# Altium project Sonar_Analog_Shield.PrjPcb
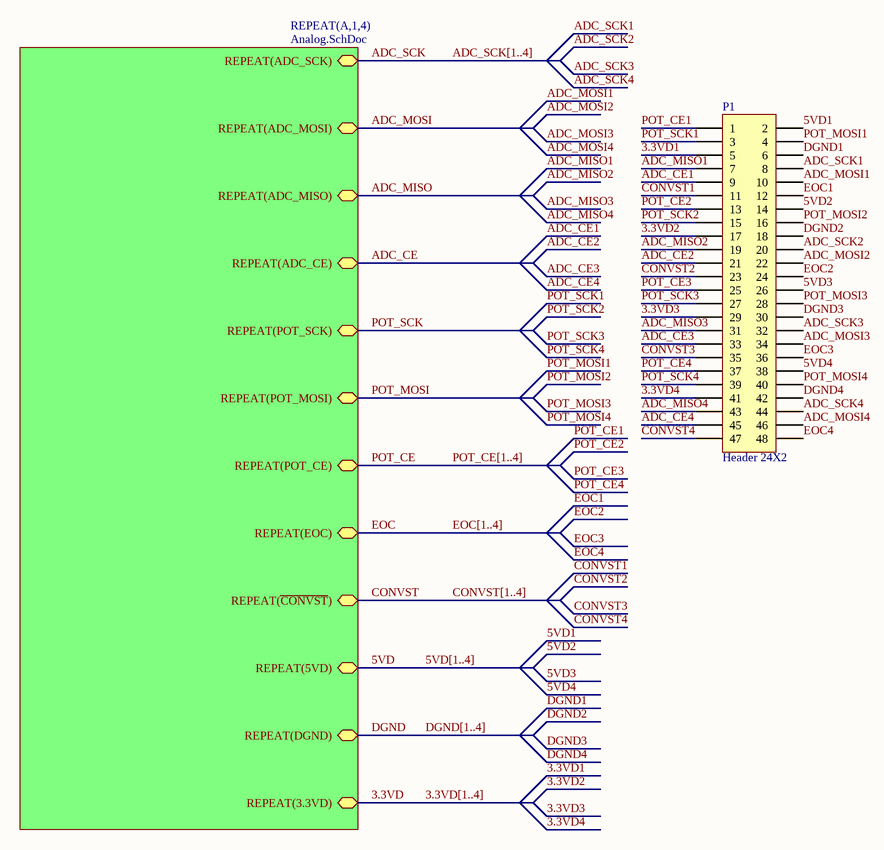
[diagram p0: Top_Level.SchDoc]
2 sheets, 165 parts. Net scope: hierarchical (ports join the sheet entries above them; power ports are global).
Board file: Analog_1.PcbDoc
Sheets:
  Top_Level.SchDoc
    A1 = Analog.SchDoc
    A2 = Analog.SchDoc
    A3 = Analog.SchDoc
    A4 = Analog.SchDoc

## Sheet Top_Level.SchDoc
size A

### Parts
P1  Header 24X2  [HDR2X24]

### Sub-sheets
REPEAT(A,1,4) = Analog.SchDoc: REPEAT(ADC_SCK) (bidir), REPEAT(ADC_MOSI) (bidir), REPEAT(ADC_MISO) (bidir), REPEAT(ADC_CE) (bidir), REPEAT(~{CONVST}) (bidir), REPEAT(EOC) (bidir), REPEAT(POT_SCK) (bidir), REPEAT(POT_MOSI) (bidir), REPEAT(POT_CE) (bidir), REPEAT(5VD) (bidir), REPEAT(DGND) (bidir), REPEAT(3.3VD) (bidir)

### Nets
5VD1: P1.2 P1.14 P1.26 P1.38  [also labelled 5VD2, 5VD3, 5VD4]
DGND1: P1.6 P1.18 P1.30 P1.42  [also labelled DGND2, DGND3, DGND4]  [project net DGND]
3.3VD: sheet REPEAT(A,1,4)/REPEAT(3.3VD)
3.3VD1: P1.5  [project net 3.3VD]
3.3VD2: P1.17  [project net 3.3VD]
3.3VD3: P1.29  [project net 3.3VD]
3.3VD4: P1.41  [project net 3.3VD]
5VD: sheet REPEAT(A,1,4)/REPEAT(5VD)
ADC_CE: sheet REPEAT(A,1,4)/REPEAT(ADC_CE)
ADC_CE1: P1.9
ADC_CE2: P1.21
ADC_CE3: P1.33
ADC_CE4: P1.45
ADC_MISO: sheet REPEAT(A,1,4)/REPEAT(ADC_MISO)
ADC_MISO1: P1.7
ADC_MISO2: P1.19
ADC_MISO3: P1.31
ADC_MISO4: P1.43
ADC_MOSI: sheet REPEAT(A,1,4)/REPEAT(ADC_MOSI)
ADC_MOSI1: P1.10
ADC_MOSI2: P1.22
ADC_MOSI3: P1.34
ADC_MOSI4: P1.46
ADC_SCK: sheet REPEAT(A,1,4)/REPEAT(ADC_SCK)
ADC_SCK1: P1.8
ADC_SCK2: P1.20
ADC_SCK3: P1.32
ADC_SCK4: P1.44
CONVST: sheet REPEAT(A,1,4)/REPEAT(~{CONVST})
CONVST1: P1.11
CONVST2: P1.23
CONVST3: P1.35
CONVST4: P1.47
DGND: sheet REPEAT(A,1,4)/REPEAT(DGND)
EOC: sheet REPEAT(A,1,4)/REPEAT(EOC)
EOC1: P1.12
EOC2: P1.24
EOC3: P1.36
EOC4: P1.48
POT_CE: sheet REPEAT(A,1,4)/REPEAT(POT_CE)
POT_CE1: P1.1  [project net POT_CE]
POT_CE2: P1.13  [project net POT_CE]
POT_CE3: P1.25  [project net POT_CE]
POT_CE4: P1.37  [project net POT_CE]
POT_MOSI: sheet REPEAT(A,1,4)/REPEAT(POT_MOSI)
POT_MOSI1: P1.4  [project net POT_MOSI]
POT_MOSI2: P1.16  [project net POT_MOSI]
POT_MOSI3: P1.28  [project net POT_MOSI]
POT_MOSI4: P1.40  [project net POT_MOSI]
POT_SCK: sheet REPEAT(A,1,4)/REPEAT(POT_SCK)
POT_SCK1: P1.3  [project net POT_SCK]
POT_SCK2: P1.15  [project net POT_SCK]
POT_SCK3: P1.27  [project net POT_SCK]
POT_SCK4: P1.39  [project net POT_SCK]

### Buses and harness runs
bus 3.3VD[1..4]
bus 5VD[1..4]
bus ADC_SCK[1..4]
bus CONVST[1..4]
bus DGND[1..4]
bus EOC[1..4]
bus POT_CE[1..4]

### Library data of the parts
P1 = Header 24X2: Header, 24-Pin, Dual row; LatestRevisionDate: 17-Jul-2002; LatestRevisionNote: Re-released for DXP Platform.; Publisher: Altium Limited; Supplier Part Number 1: 952-1917-ND; Supplier 1: Digi-Key

## Sheet Analog.SchDoc
size 381 x 241 mm
Used 4 times, as channels A1, A2, A3, A4. Parts and nets are listed once, with the designators drawn on the sheet.
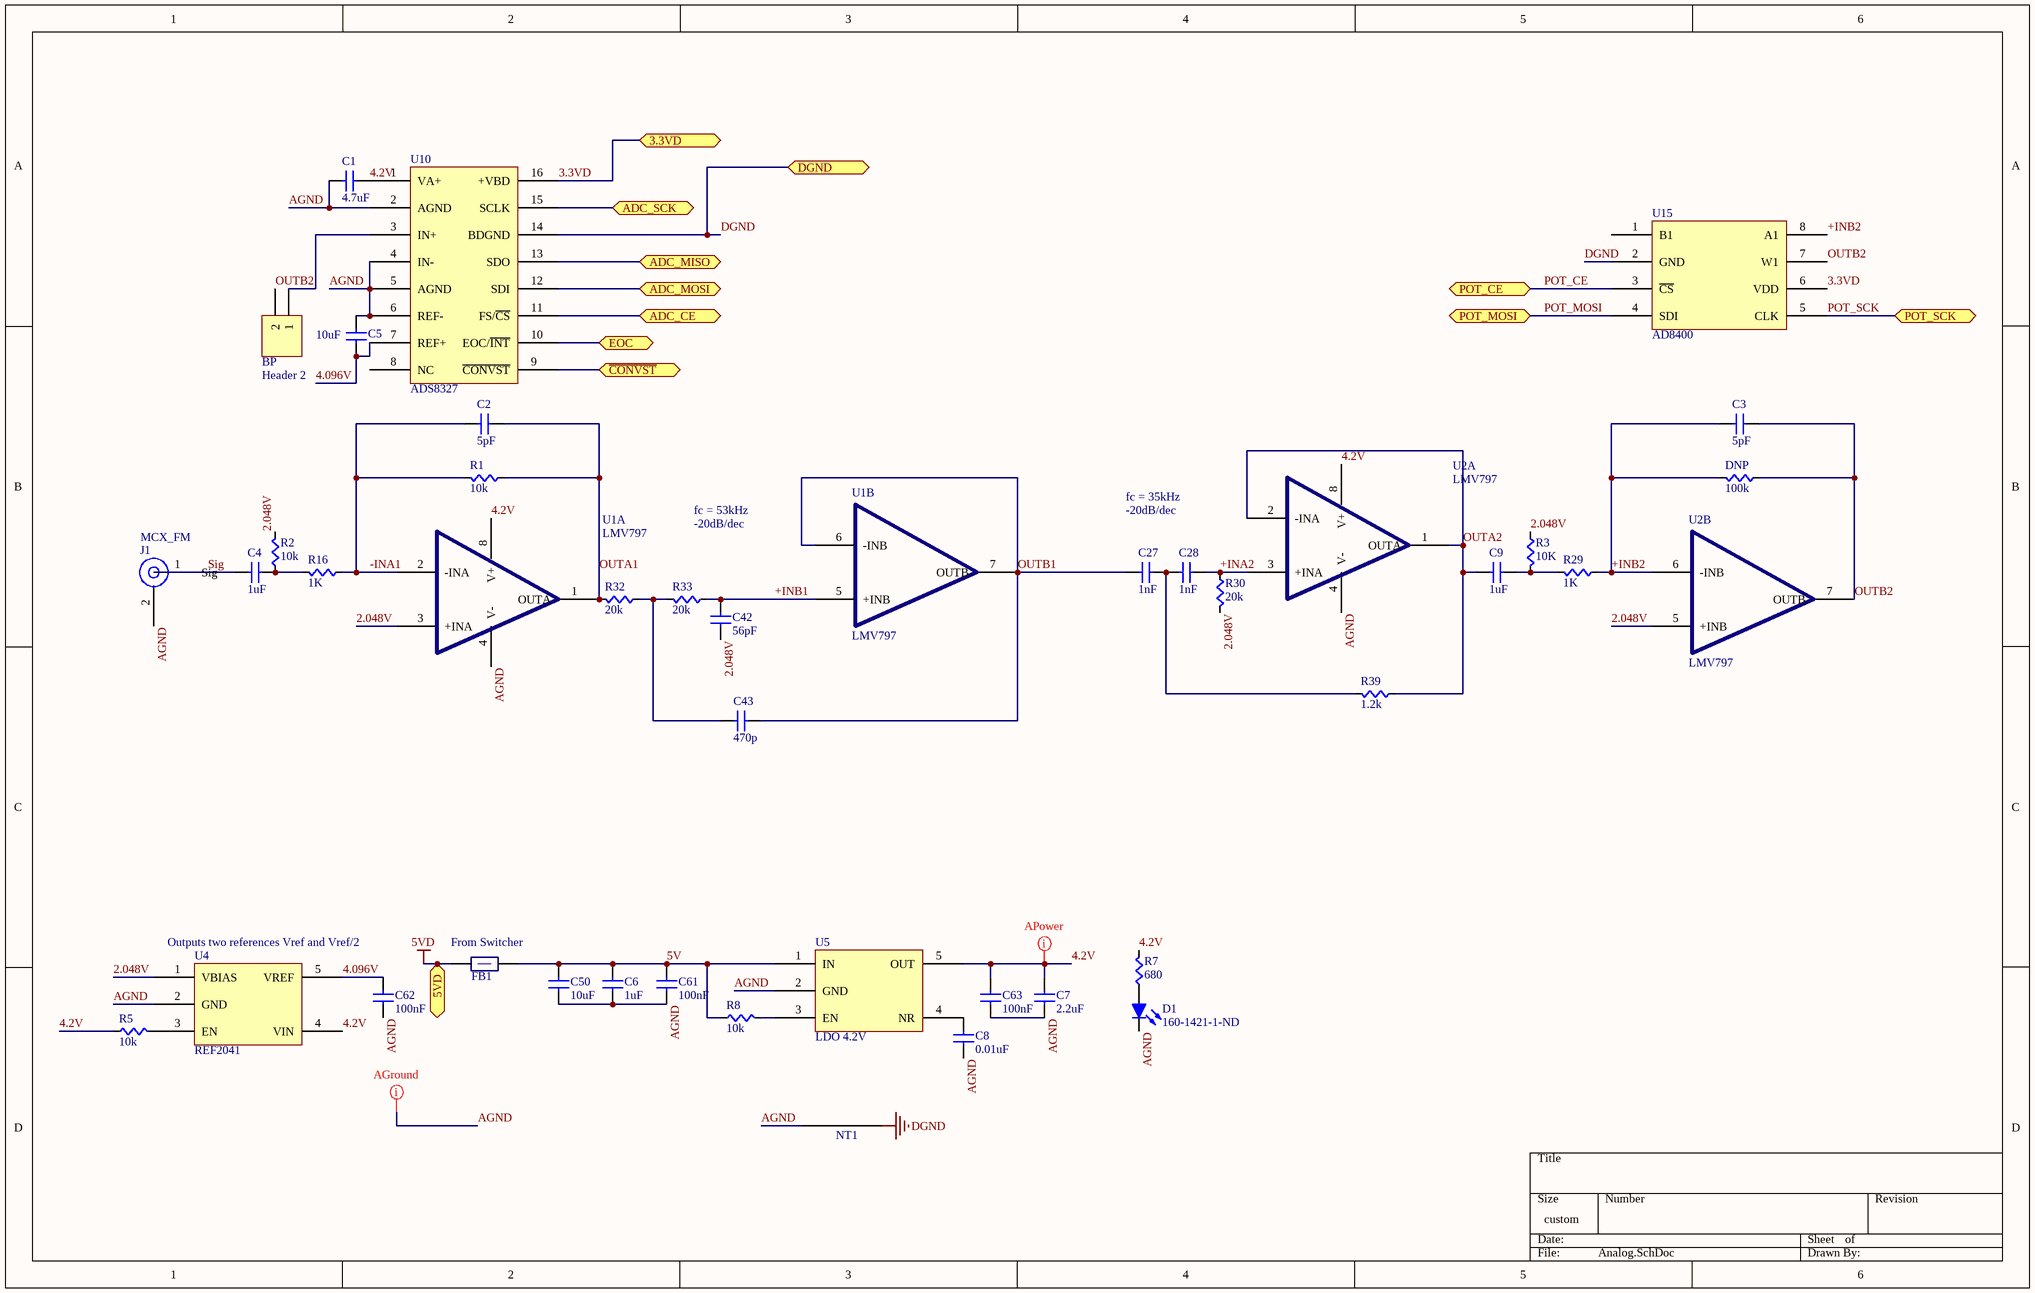
[diagram p1: Analog.SchDoc]

### Parts
BP  Header 2  [HDR1X2]
C1  value 4.7uF  [CAPC0603]  (hidden comment: Cap)
C2  value 5pF  [CAPC0603]  (hidden comment: Cap)
C3  value 5pF  [CAPC0603]  (hidden comment: Cap)
C4  value 1uF  [CAPC0603]  (hidden comment: Cap)
C5  value 10uF  [CAPC0603]  (hidden comment: Cap)
C6  value 1uF  [CAPC0603]  (hidden comment: Cap)
C7  value 2.2uF  [CAPC0603]  (hidden comment: Cap)
C8  value 0.01uF  [CAPC0603]  (hidden comment: Cap)
C9  value 1uF  [CAPC0603]  (hidden comment: Cap)
C27  value 1nF  [CAPC0603]  (hidden comment: Cap)
C28  value 1nF  [CAPC0603]  (hidden comment: Cap)
C42  value 56pF  [CAPC0603]  (hidden comment: Cap)
C43  value 470p  [CAPC0603]  (hidden comment: Cap)
C50  value 10uF  [CAPC0603]  (hidden comment: Cap)
C61  value 100nF  [CAPC0603]  (hidden comment: Cap)
C62  value 100nF  [CAPC0603]  (hidden comment: Cap)
C63  value 100nF  [CAPC0603]  (hidden comment: Cap)
D1  Supplier Part Number 1: 160-1421-1-ND  [LED0805-RED]  (hidden comment: LED-RED)
DNP  value 100k  [RES0603]  (hidden comment: Res)
FB1  FBead  [RES0603]  (value not drawn)
J1  MCX_FM  [MCX_FEMALE]
NT1  NetTie  [NT_5mil]  (value not drawn)  (net tie, no BOM)
R1  value 10k  [RES0603]  (hidden comment: Res)
R2  value 10k  [RES0603]  (hidden comment: Res)
R3  value 10K  [RES0603]  (hidden comment: Res)
R5  value 10k  [RES0603]  (hidden comment: Res)
R7  value 680  [RES0603]  (hidden comment: Res)
R8  value 10k  [RES0603]  (hidden comment: Res)
R16  value 1K  [RES0603]  (hidden comment: Res)
R29  value 1K  [RES0603]  (hidden comment: Res)
R30  value 20k  [RES0603]  (hidden comment: Res)
R32  value 20k  [RES0603]  (hidden comment: Res)
R33  value 20k  [RES0603]  (hidden comment: Res)
R39  value 1.2k  [RES0603]  (hidden comment: Res)
U1  LMV797  [TSSOP-8N]  (parts A,B of 2)
U2  LMV797  [TSSOP-8N]  (parts A,B of 2)
U4  REF2041  [SOT23-5]
U5  LDO 4.2V  [sot23-5]
U10  ADS8327  [TSSOP-16pin]
U15  AD8400  [SOIC-8PIN]

### Ports
3.3VD (bidir), 5VD (bidir), ADC_CE (bidir), ADC_MISO (bidir), ADC_MOSI (bidir), ADC_SCK (bidir), DGND (bidir), EOC (bidir), POT_CE (bidir), POT_MOSI (bidir), POT_SCK (bidir), ~{CONVST} (bidir)

### Nets
5VD: FB1.1(A) ; port 5VD
DGND: NT1.2 U10.14(BDGND) U15.2(GND) ; port DGND
2.048V: C42.1(A) R2.1(A) R3.2(B) R30.1(A) U1.3(+INA) U2.5(+INB) U4.1(VBIAS)
3.3VD: U10.16(+VBD) U15.6(VDD) ; port 3.3VD
4.2V: C1.2(B) C7.2(B) C63.1(A) R5.2(B) R7.1(A) U1.8(V+) U2.8(V+) U4.4(VIN) U5.5(OUT) U10.1(VA+)
4.096V: C5.2(B) C62.1(A) U4.5(VREF) U10.7(REF+)
5V: C6.2(B) C50.1(A) C61.1(A) FB1.2(B) R8.2(B) U5.1(IN)
+INA2: C28.2(B) R30.2(B) U2.3(+INA)
+INB1: C42.2(B) R33.2(B) U1.5(+INB)
+INB2: C3.1(A) DNP.1(A) R29.2(B) U2.6(-INB) U15.8(A1)
-INA1: C2.1(A) R1.1(A) R16.2(B) U1.2(-INA)
ADC_CE: U10.11(FS/~{CS}) ; port ADC_CE
ADC_MISO: U10.13(SDO) ; port ADC_MISO
ADC_MOSI: U10.12(SDI) ; port ADC_MOSI
ADC_SCK: U10.15(SCLK) ; port ADC_SCK
AGND: C1.1(A) C5.1(A) C6.1(A) C7.1(A) C8.1(A) C50.2(B) C61.2(B) C62.2(B) C63.2(B) D1.1(K) J1.2(GND) NT1.1 U1.4(V-) U2.4(V-) U4.2(GND) U5.2(GND) U10.2(AGND) U10.4(IN-) U10.5(AGND) U10.6(REF-)
~{CONVST}: U10.9(~{CONVST}) ; port ~{CONVST}
EOC: U10.10(EOC/~{INT}) ; port EOC
OUTA1: C2.2(B) R1.2(B) R32.1(A) U1.1(OUTA)
OUTA2: C9.1(A) R39.2(B) U2.1(OUTA) U2.2(-INA)
OUTB1: C27.1(A) C43.1(A) U1.6(-INB) U1.7(OUTB)
OUTB2: BP.2 C3.2(B) DNP.2(B) U2.7(OUTB) U15.7(W1)
POT_CE: U15.3(~{CS}) ; port POT_CE
POT_MOSI: U15.4(SDI) ; port POT_MOSI
POT_SCK: U15.5(CLK) ; port POT_SCK
Sig: C4.1(A) J1.1(Sig)
NetBP_1: BP.1 U10.3(IN+)
NetC4_2: C4.2(B) R2.2(B) R16.1(A)
NetC8_2: C8.2(B) U5.4(NR)
NetC9_2: C9.2(B) R3.1(A) R29.1(A)
NetC27_2: C27.2(B) C28.1(A) R39.1(A)
NetC43_2: C43.2(B) R32.2(B) R33.1(A)
NetD1_2: D1.2(A) R7.2(B)
NetR5_1: R5.1(A) U4.3(EN)
NetR8_1: R8.1(A) U5.3(EN)

Not connected (* = marked no-connect by the designer): U10 8(NC); U15 1(B1)

### Channels
A1: designators end in _A1; ports 3.3VD=3.3VD 5VD=5VD1 ADC_CE=ADC_CE1 ADC_MISO=ADC_MISO1 ADC_MOSI=ADC_MOSI1 ADC_SCK=ADC_SCK1 DGND=DGND EOC=EOC1 POT_CE=POT_CE POT_MOSI=POT_MOSI POT_SCK=POT_SCK ~{CONVST}=CONVST1
A2: designators end in _A2; ports 3.3VD=3.3VD 5VD=5VD1 ADC_CE=ADC_CE2 ADC_MISO=ADC_MISO2 ADC_MOSI=ADC_MOSI2 ADC_SCK=ADC_SCK2 DGND=DGND EOC=EOC2 POT_CE=POT_CE POT_MOSI=POT_MOSI POT_SCK=POT_SCK ~{CONVST}=CONVST2
A3: designators end in _A3; ports 3.3VD=3.3VD 5VD=5VD1 ADC_CE=ADC_CE3 ADC_MISO=ADC_MISO3 ADC_MOSI=ADC_MOSI3 ADC_SCK=ADC_SCK3 DGND=DGND EOC=EOC3 POT_CE=POT_CE POT_MOSI=POT_MOSI POT_SCK=POT_SCK ~{CONVST}=CONVST3
A4: designators end in _A4; ports 3.3VD=3.3VD 5VD=5VD1 ADC_CE=ADC_CE4 ADC_MISO=ADC_MISO4 ADC_MOSI=ADC_MOSI4 ADC_SCK=ADC_SCK4 DGND=DGND EOC=EOC4 POT_CE=POT_CE POT_MOSI=POT_MOSI POT_SCK=POT_SCK ~{CONVST}=CONVST4

### Layout directives
net class AGround: AGND_A1
net class APower: 4.2V_A1

### Notes on the sheet
- fc = 35kHz
- fc = 53kHz
- -20dB/dec
- Outputs two references Vref and Vref/2
- (near FB1) From Switcher

### Library data of the parts
BP = Header 2: Header, 2-Pin; LatestRevisionDate: 17-Jul-2002; LatestRevisionNote: Re-released for DXP Platform.; Publisher: Altium Limited; Supplier Part Number 1: A1921-ND; Supplier 1: Digi-Key
D1 = LED-RED: Light Emitting Diode - RED; Manufacturer Part Number: LTST-C171CKT; Manufacturer: Lite-On Inc; Voltage - Forward (Vf) Typ: 1.8V; Current - Test: 20mA; Millicandela Rating: 25mcd; Viewing Angle: 130°; Color: Red; Supplier 1: Digi-Key; Package / Case: 0805 (2012 Metric)
FB1 = FBead: Ferrite Bead; Supplier 1: Digi-Key; Supplier Part Number 1: 445-2988-1-ND
J1 = MCX_FEMALE: MCX female receptacle RA; Supplier 1: Digi-Key; Supplier Part Number 1: A98546-ND
NT1 = NetTie: Ties two nets together
U1 U2 = LMV797: IC OPAMP GP 17MHZ RRO 8VSSOP; Supplier 1: Digi-Key; Supplier Part Number 1: LMV797MM/NOPBCT-ND
U4 = REF2041: IC VREF SERIES 2.05V/4.096V 5SOT; Supplier 1: Digi-Key; Supplier Part Number 1: 296-38497-1-ND
U5 = LDO 4.2V 200mA: IC REG LDO 4.2V 0.2A 5SOT; Supplier 1: Digi-Key; Supplier Part Number 1: 296-32585-1-ND
U10 = ADC 16bit 500k: IC ADC 16BIT 500KSPS 16-TSSOP; Supplier 1: Digi-Key; Supplier Part Number 1: 296-19764-ND
U15 = AD8400: IC DGTL POT 8BIT 100K 1CH 8-SOIC; Supplier 1: Digi-Key; Supplier Part Number 1: AD8400ARZ100-ND
C1-C9 C27 C28 C42 C43 C50 C61-C63 = Cap: Supplier 1: Digi-Key; Supplier Part Number 1: 1276-1000-1-ND
DNP R1-R3 R5 R7 R8 R16 R29 R30 R32 R33 R39 = Res: Supplier 1: Digi-Key; Supplier Part Number 1: RMCF0603JT10K0CT-ND

## Nets that join several sheets
5VD1: Top_Level (P1.2 P1.14 P1.26 P1.38), A1 (FB1_A1.1), A2 (FB1_A2.1), A3 (FB1_A3.1), A4 (FB1_A4.1)
DGND: Top_Level (P1.6 P1.18 P1.30 P1.42), A1 (NT1_A1.2 U10_A1.14 U15_A1.2), A2 (NT1_A2.2 U10_A2.14 U15_A2.2), A3 (NT1_A3.2 U10_A3.14 U15_A3.2), A4 (NT1_A4.2 U10_A4.14 U15_A4.2)
3.3VD: Top_Level (P1.5), A1 (U10_A1.16 U15_A1.6)
3.3VD: Top_Level (P1.17), A2 (U10_A2.16 U15_A2.6)
3.3VD: Top_Level (P1.29), A3 (U10_A3.16 U15_A3.6)
3.3VD: Top_Level (P1.41), A4 (U10_A4.16 U15_A4.6)
ADC_CE1: Top_Level (P1.9), A1 (U10_A1.11)
ADC_CE2: Top_Level (P1.21), A2 (U10_A2.11)
ADC_CE3: Top_Level (P1.33), A3 (U10_A3.11)
ADC_CE4: Top_Level (P1.45), A4 (U10_A4.11)
ADC_MISO1: Top_Level (P1.7), A1 (U10_A1.13)
ADC_MISO2: Top_Level (P1.19), A2 (U10_A2.13)
ADC_MISO3: Top_Level (P1.31), A3 (U10_A3.13)
ADC_MISO4: Top_Level (P1.43), A4 (U10_A4.13)
ADC_MOSI1: Top_Level (P1.10), A1 (U10_A1.12)
ADC_MOSI2: Top_Level (P1.22), A2 (U10_A2.12)
ADC_MOSI3: Top_Level (P1.34), A3 (U10_A3.12)
ADC_MOSI4: Top_Level (P1.46), A4 (U10_A4.12)
ADC_SCK1: Top_Level (P1.8), A1 (U10_A1.15)
ADC_SCK2: Top_Level (P1.20), A2 (U10_A2.15)
ADC_SCK3: Top_Level (P1.32), A3 (U10_A3.15)
ADC_SCK4: Top_Level (P1.44), A4 (U10_A4.15)
CONVST1: Top_Level (P1.11), A1 (U10_A1.9)
CONVST2: Top_Level (P1.23), A2 (U10_A2.9)
CONVST3: Top_Level (P1.35), A3 (U10_A3.9)
CONVST4: Top_Level (P1.47), A4 (U10_A4.9)
EOC1: Top_Level (P1.12), A1 (U10_A1.10)
EOC2: Top_Level (P1.24), A2 (U10_A2.10)
EOC3: Top_Level (P1.36), A3 (U10_A3.10)
EOC4: Top_Level (P1.48), A4 (U10_A4.10)
POT_CE: Top_Level (P1.1), A1 (U15_A1.3)
POT_CE: Top_Level (P1.13), A2 (U15_A2.3)
POT_CE: Top_Level (P1.25), A3 (U15_A3.3)
POT_CE: Top_Level (P1.37), A4 (U15_A4.3)
POT_MOSI: Top_Level (P1.4), A1 (U15_A1.4)
POT_MOSI: Top_Level (P1.16), A2 (U15_A2.4)
POT_MOSI: Top_Level (P1.28), A3 (U15_A3.4)
POT_MOSI: Top_Level (P1.40), A4 (U15_A4.4)
POT_SCK: Top_Level (P1.3), A1 (U15_A1.5)
POT_SCK: Top_Level (P1.15), A2 (U15_A2.5)
POT_SCK: Top_Level (P1.27), A3 (U15_A3.5)
POT_SCK: Top_Level (P1.39), A4 (U15_A4.5)